# EasyEDA Pro project ProPrj_Lan_Relay_blog_2026-03-05_10-33-51_2026-03-13.epro, board PCB1
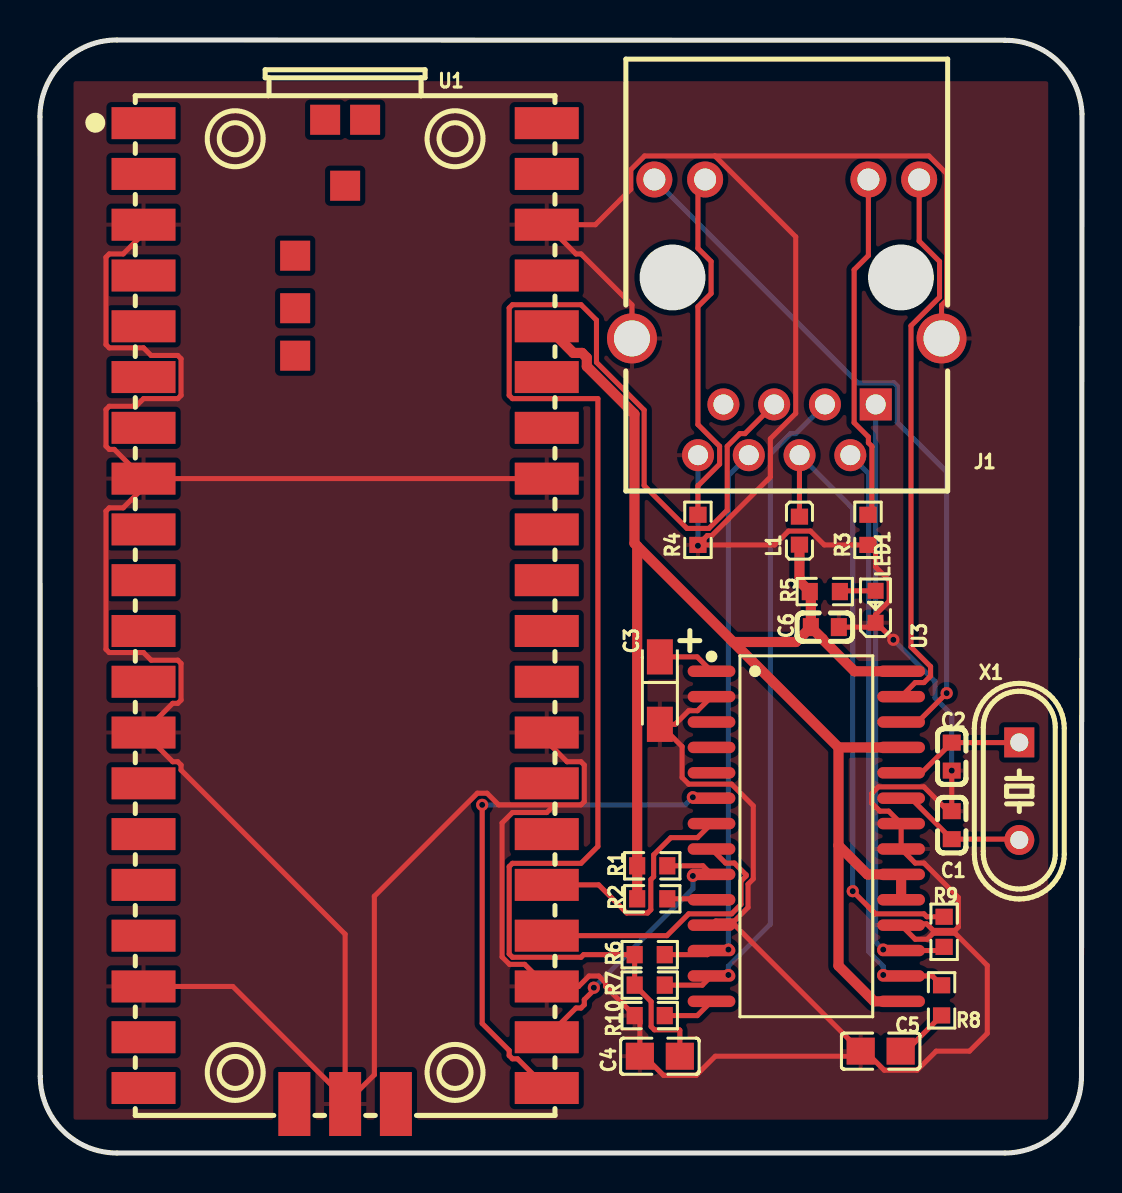
[diagram p3: board, top side]
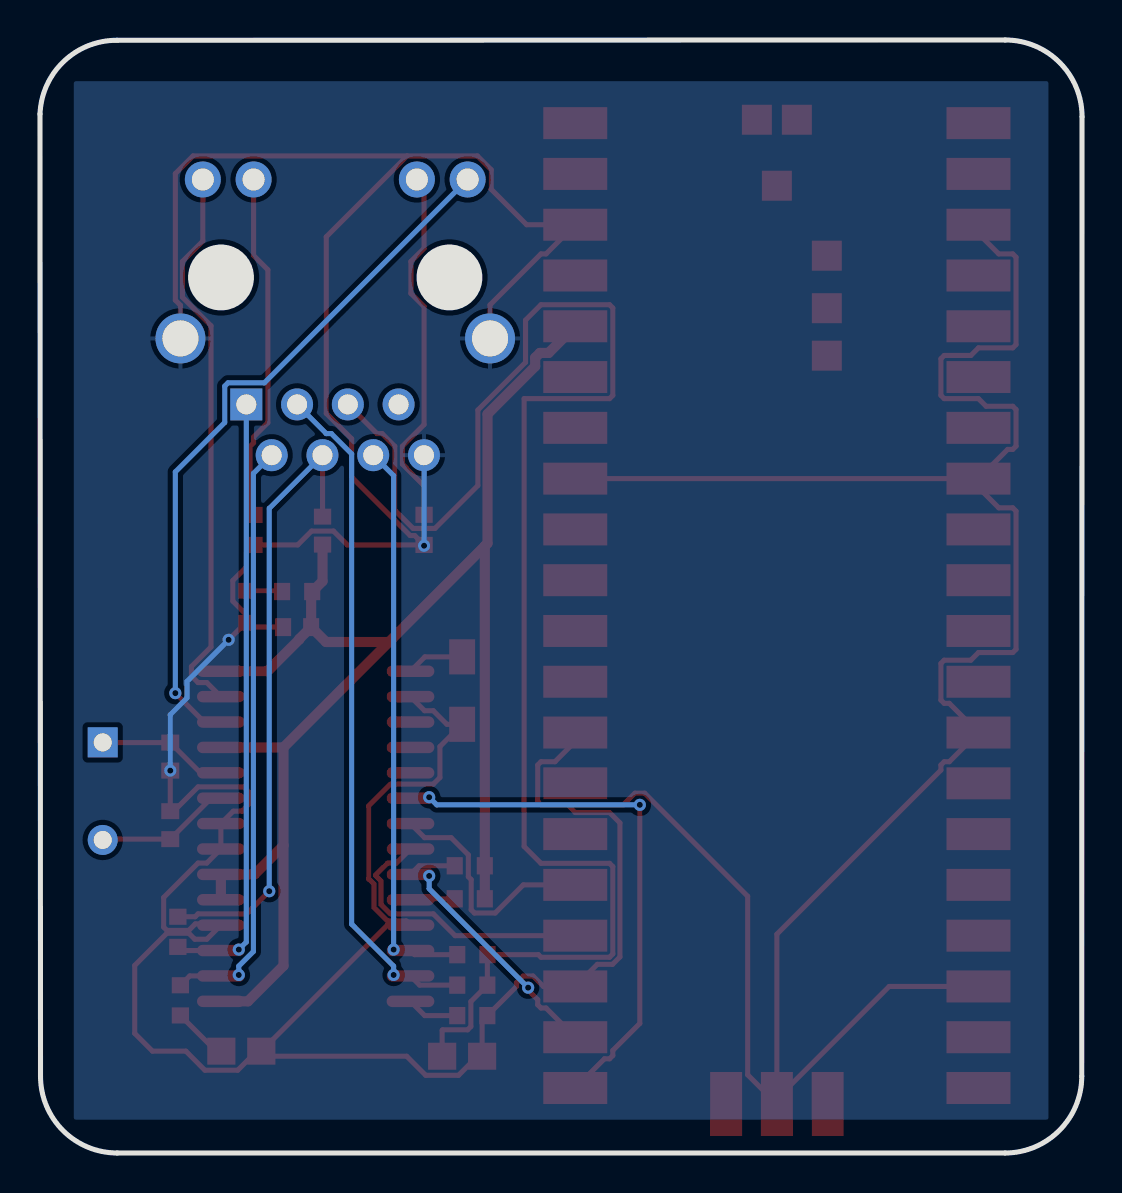
[diagram p4: board, bottom side, seen from below]

Outline 52.14 x 55.67 mm; copper layers: Top Layer, Bottom Layer. Coordinates in mm from the lower left corner of the outline.
Outline path: 0,51.83 arc(1.12,54.55) 3.84,55.67 48.29,55.66 arc(50.96,54.59) 52.14,51.96 52.11,3.84 arc(50.99,1.12) 48.27,0 3.85,0 arc(1.14,1.12) 0.01,3.84 0,51.83
Stack: Top Layer 0.035mm / Dielectric1 1.51mm FR4 er 4.5 / Bottom Layer 0.035mm

## Design rules (mm)
template: JLCPCB Capability(Two Layers Board)
spacing copperThickness1oz (default): track to track 0.102, other pairs 0.152 to 0.3
spacing copperThickness2oz: track to track 0.203, other pairs 0.152 to 0.3
track width copperThickness1oz (default): min 0.127, default 0.254, max 2.54
track width copperThickness2oz: min 0.203, default 0.254, max 2.54
differential pair differentialPair (default): width min 0.127, default 0.254, max 2.54; gap min 0.152, default 0.152
via viaSize (default): diameter min 0.5, default 0.61, max 10; hole min 0.3, default 0.305, max 6.3

## Placement (name value [footprint] x y rotation side)
C1  18pF  [C0603]  45.62 16.4 270 top
C2  18pF  [C0603]  45.62 19.83 90 top
C3  10uF  [CAP-SMD_L3.2-W1.6-RD-C7171]  31.02 23.13 270 top
C4  100nF  [C0805]  31.02 4.84 0 top
C5  100nF  [C0805]  42.07 5.09 0 top
C6  10nF  [C0603]  39.27 26.3 0 top
J1  HR911105A  [RJ45-TH_HR911105A]  37.37 41.8 180 top
L1  GZ1608D601TF  [L0603]  38 31.13 90 top
LED1  KT-0603R  [LED0603-RD]  41.81 27.32 90 top
R1  10kΩ  [R0603]  30.64 14.37 0 top
R2  10kΩ  [R0603]  30.64 12.71 0 top
R3  1kΩ  [R0603]  41.43 31.17 90 top
R4  1kΩ  [R0603]  32.92 31.17 90 top
R5  1kΩ  [R0603]  39.27 28.08 180 top
R6  50Ω  [R0603]  30.51 9.92 0 top
R7  50Ω  [R0603]  30.51 8.4 180 top
R8  50Ω  [R0603]  45.11 7.63 90 top
R9  50Ω  [R0603]  45.24 11.06 90 top
R10  2.32kΩ  [R0603]  30.51 6.87 0 top
U1  PICO  [COMM-SMD_L51.0-W21.0-P2.54_SC0916]  15.27 27.07 270 top
U3  ENC28J60-I/SO  [SOIC-28_L17.9-W7.5-P1.27-LS10.3-BL]  38.35 15.84 270 top
X1  25MHz  [HC-49US_L11.5-W4.5-P4.88]  49 18.1 270 top

## Footprints (pads in the part's own frame, mm; a bottom-side part is the same pattern mirrored in y, then rotated)
C0603
  rect 0.8x0.9 smd: 1(-0.7,0) 2(0.7,0)
C0805
  rect 1.41x1.35 smd: 1(-1,0) 2(1,0)
CAP-SMD_L3.2-W1.6-RD-C7171
  rect 1.758x1.296 smd: 1(-1.687,0) 2(1.687,0)
COMM-SMD_L51.0-W21.0-P2.54_SC0916
  rect 1.6x3.2 smd: 1(-24.445,-10.088) 2(-21.905,-10.088) 3(-19.365,-10.088) 4(-16.825,-10.088) 5(-14.285,-10.088) 6(-11.745,-10.088) 7(-9.205,-10.088) 8(-6.665,-10.088) 9(-4.125,-10.088) 10(-1.585,-10.088) 11(0.955,-10.088) 12(3.495,-10.088) 13(6.035,-10.088) 14(8.575,-10.088) 15(11.115,-10.088) 16(13.655,-10.088) 17(16.195,-10.088) 18(18.735,-10.088) 19(21.275,-10.088) 20(23.815,-10.088) 21(23.815,10.088) 22(21.275,10.088) 23(18.735,10.088) 24(16.195,10.088) 25(13.655,10.088) 26(11.115,10.088) 27(8.575,10.088) 28(6.035,10.088) 29(3.495,10.088) 30(0.955,10.088) 31(-1.585,10.088) 32(-4.125,10.088) 33(-6.665,10.088) 34(-9.205,10.088) 35(-11.745,10.088) 36(-14.285,10.088) 37(-16.825,10.088) 38(-19.365,10.088) 39(-21.905,10.088) 40(-24.445,10.088)
  rect 3.2x1.6 smd: 41(24.615,-2.54) 42(24.615,0) 43(24.615,2.54)
  rect 1.5x1.5 smd: TP1(-21.315,0) TP2(-24.615,1) TP3(-24.615,-1) TP4(-17.815,-2.5) TP5(-15.188,-2.5) TP6(-12.815,-2.5)
HC-49US_L11.5-W4.5-P4.88
  rect 1.5x1.5 hole 0.9: 1(-2.44,0)
  round 1.5 hole 0.9: 2(2.44,0)
L0603
  rect 0.8x0.864 smd: 1(-0.7,0) 2(0.7,0)
LED0603-RD
  rect 0.8x0.8 smd: 1(-0.799,0) 2(0.799,0)
R0603
  rect 0.806x0.864 smd: 1(-0.753,0) 2(0.753,0)
RJ45-TH_HR911105A
  rect 1.6x1.6 hole 1: 1(-4.45,4.355)
  round 1.6 hole 1: 2(-3.18,6.895) 3(-1.91,4.355) 4(-0.64,6.895) 5(0.63,4.355) 6(1.9,6.895) 7(3.17,4.355) 8(4.44,6.895)
  round 1.8 hole 1.1: 9(-6.625,-6.895) 10(-4.085,-6.895) 11(4.085,-6.895) 12(6.625,-6.895)
  round 2.5 hole 1.8: SH1(-7.745,1.055) SH2(7.745,1.055)
SOIC-28_L17.9-W7.5-P1.27-LS10.3-BL
  oval 0.574x2.388 smd: 1(-8.255,-4.744) 2(-6.985,-4.744) 3(-5.715,-4.744) 4(-4.445,-4.744) 5(-3.175,-4.744) 6(-1.905,-4.744) 7(-0.635,-4.744) 8(0.635,-4.744) 9(1.905,-4.744) 10(3.175,-4.744) 11(4.445,-4.744) 12(5.715,-4.744) 13(6.985,-4.744) 14(8.255,-4.744) 15(8.255,4.744) 16(6.985,4.744) 17(5.715,4.744) 18(4.445,4.744) 19(3.175,4.744) 20(1.905,4.744) 21(0.635,4.744) 22(-0.635,4.744) 23(-1.905,4.744) 24(-3.175,4.744) 25(-4.445,4.744) 26(-5.715,4.744) 27(-6.985,4.744) 28(-8.255,4.744)

## Nets
As in the schematic.

Pads without a net: J1 7; U1 1 2 4 5 6 7 9 10 11 12 14 15 16 17 19 20 26 27 29 30 31 32 34 35 37 39 40 41 43 TP1 TP2 TP3 TP4 TP5 TP6; U3 3 4 5

## Via types
v1: diameter 0.61, hole 0.305, Top Layer to Bottom Layer, 13 vias

## Routing (per net, layer and track width the routed paths; a pad name or vN(x,y) marks a point on that pad's centre or on a via; arc(x,y) is an arc through that point)
+3.3V: length 81.9
  Top Layer w0.508: U3.28 40.76,24.1 39.17,25.69 39.17,25.71 C6.1 ; 39.96,20.29 39.96,15.38 ; 39.96,20.29 U3.25 ; 39.96,20.29 34.68,25.56 ; 39.96,15.38 41.4,13.94 U3.20 U3.19 ; 39.96,15.38 39.96,9.36 41.73,7.59 U3.15 ; 29.88,30.36 R1.1 R2.1 ; 29.88,30.36 29.75,30.49 29.75,36.96 27.36,39.34 27.36,39.78 27.12,40.02 26.69,40.02 U1.36 ; 29.88,30.36 34.68,25.56 ; C6.1 38.57,28.03 R5.2 38,28.6 L1.1 ; C6.1 37.83,25.56 34.68,25.56
GND: length 309.6
  Top Layer w0.254: C5.1 40.81,4.84 33.79,4.84 32.84,3.89 31.2,3.89 30.24,4.84 C4.1 30.02,6.61 R10.1 28.3,8.33 28.3,8.51 27.96,8.85 27.47,8.85 26.95,8.33 U1.23 24.25,9.44 23.49,9.44 23.12,9.81 23.12,16.51 23.64,17.03 25.36,17.03 25.74,17.41 ; C5.1 34.77,11.4 U3.11 33.81,11.61 34.75,11.61 35.43,12.28 35.43,13.45 35.69,13.71 35.69,17.36 34.61,18.45 32.46,18.45 32.13,18.78 32.13,20.33 C3.2 31.78,21.44 32.46,22.12 32.9,22.12 U3.2 ; C5.1 41.29,5.09 42.25,4.14 43.89,4.14 44.84,5.09 46.51,5.09 47.4,5.98 47.4,9.38 45.79,10.99 44.69,10.99 44.39,10.69 43.79,10.69 U3.18 43.15,11.46 44.37,11.46 44.69,11.13 45.79,11.13 45.95,11.3 45.95,12.78 44.23,14.5 43.79,14.5 U3.21 U3.22 42.47,17.1 42.03,17.1 41.62,17.51 41.62,17.98 41.95,18.31 44.23,18.31 45.45,17.1 C1.1 v1(45.62,19.13) ; 33.77,49.87 30.25,49.87 29.56,49.18 29.56,48.2 27.79,46.43 U1.38 26.82,44.97 27.07,44.97 29.62,42.42 J1.SH2 ; 33.77,49.87 44.48,49.87 45.37,48.99 45.37,42.66 45.11,42.4 J1.SH1 ; 33.77,49.87 37.82,45.83 37.82,37 36.55,35.73 36.55,33.81 33.62,30.88 33.39,30.88 R4.1 36.76,30.42 37.45,31.11 38.55,31.11 39.24,30.42 R3.1 41.81,30.03 41.81,29.31 42.49,28.63 42.49,27.6 41.81,26.92 LED1.1 ; C6.2 41.6,26.3 LED1.1 ; U1.8 3.72,35.19 3.47,35.19 3.3,35.36 3.3,37.19 3.47,37.35 4.8,37.35 5.18,37.73 6.9,37.73 7.06,37.9 7.06,39.73 6.9,39.89 5.56,39.89 5.18,40.27 3.47,40.27 3.3,40.44 3.3,44.81 3.47,44.97 4.17,44.97 5.18,45.99 U1.3 ; U1.8 U1.33 ; U1.8 5.18,33.29 4.17,32.27 3.47,32.27 3.3,32.11 3.3,25.2 3.47,25.03 5.18,25.03 5.56,24.65 6.9,24.65 7.06,24.49 7.06,22.66 6.9,22.49 6.64,22.49 U1.13 6.64,19.57 6.9,19.57 7.06,19.41 7.06,19.15 15.27,10.94 15.27,2.71 ; 25.74,17.41 27.07,17.41 27.24,17.58 27.24,19.41 27.07,19.57 26.37,19.57 25.36,20.59 U1.28 ; 25.74,17.41 22.96,17.41 22.37,18 21.89,18 16.73,12.84 16.73,3.91 U1.42 15.27,2.71 ; U1.18 9.65,8.33 15.27,2.71 ; LED1.1 41.85,26.52 v1(42.7,25.67)
  Bottom Layer w0.254: v1(45.62,19.13) 45.62,21.92 44.78,22.76 44.78,23.59 v1(42.7,25.67) ; v1(32.92,30.37) 32.92,34.9 J1.8
CS: length 13.6
  Top Layer w0.254: v1(27.72,8.27) 27.72,8.15 27.24,7.67 27.24,7.42 27.07,7.25 26.82,7.25 U1.22 ; R1.2 33.17,14.37 U3.9
  Bottom Layer w0.254: v1(27.72,8.27) 32.67,13.22 v1(32.67,13.86)
LEDA: length 28.2
  Top Layer w0.254: U3.27 43.79,23.53 44.23,23.53 44.56,23.86 44.56,24.33 43.58,25.31 43.58,41.38 45.01,42.8 45.01,44.59 43.99,45.61 J1.9
LEDB: length 35.7
  Top Layer w0.254: U3.26 43.92,21.56 v1(45.37,23)
  Bottom Layer w0.254: J1.12 40.91,38.52 42.73,38.52 42.9,38.36 42.9,36.54 45.37,34.07 v1(45.37,23)
MISO: length 26.3
  Top Layer w0.254: v1(22.13,17.41) 22.13,6.48 23.48,5.13 23.48,4.88 23.64,4.71 23.9,4.71 U1.21
  Bottom Layer w0.254: v1(32.67,17.79) 32.29,17.41 v1(22.13,17.41)
MOSI: length 12.2
  Top Layer w0.254: U1.25 27.96,13.41 29.36,12 30.4,12 30.57,12.17 30.57,13.68 30.71,13.82 30.71,14.91 31.57,15.77 32.9,15.77 U3.7
RESET: length 2.2
  Top Layer w0.254: U3.10 33.55,12.71 R2.2
SCK: length 14.2
  Top Layer w0.254: U3.8 34.31,14.5 34.74,14.5 35.34,13.91 35.34,13.86 35.08,13.6 35.08,12.43 34.61,11.96 32.46,11.96 31.37,10.87 U1.24
TPIN+: length 33.2
  Top Layer w0.254: U3.13 33.14,8.4 R7.1
  Bottom Layer w0.254: v1(34.45,8.9) 34.45,9.35 36.55,11.45 36.55,34.97 37.56,35.98 37.82,35.98 J1.3
TPIN-: length 27.6
  Top Layer w0.254: R6.2 33.4,9.92 U3.12
  Bottom Layer w0.254: v1(34.45,10.17) 34.45,33.88 J1.6
TPOUT+: length 29.7
  Top Layer w0.254: U3.17 45.06,10.13 R9.1
  Bottom Layer w0.254: v1(42.19,10.17) 41.82,10.55 J1.1
TPOUT-: length 28.9
  Top Layer w0.254: R8.2 44.65,8.86 U3.16
  Bottom Layer w0.254: v1(42.19,8.9) 42.19,9.35 41.46,10.08 41.46,33.99 J1.2
$1N1237: length 2.6
  Top Layer w0.254: R10.2 32.89,6.87 U3.14
$1N1253: length 2.9
  Top Layer w0.254: C3.1 32.88,24.82 U3.1
$1N1258: length 33.9
  Top Layer w0.254: L1.2 38,34.9 38.01,34.9 ; v1(40.67,13.1) 41.8,11.96 44.23,11.96 44.38,11.82 R9.2 ; R8.1 43.33,5.09 C5.2
  Bottom Layer w0.254: 38.01,34.9 40.67,32.24 v1(40.67,13.1)
$1N1264: length 79.5
  Top Layer w0.254: J1.5 35.28,35.98 35.02,35.98 34.39,35.35 34.39,32.16 33.47,31.24 32.37,31.24 30.23,33.38 30.23,37.16 27.85,39.54 27.85,41.66 27.07,42.43 23.64,42.43 23.48,42.27 23.48,37.9 23.64,37.73 27.92,37.73 27.92,15.33 27.07,14.49 23.64,14.49 23.48,14.33 23.48,9.96 23.64,9.79 27.07,9.79 27.2,9.92 R6.1 R7.2 30.58,7.57 30.58,6.33 30.74,6.16 31.99,6.16 32.02,6.14 C4.2
$1N1268: length 6.8
  Top Layer w0.254: X1.2 48.96,15.7 C1.2 43.57,17.75 U3.23
$1N1269: length 6.5
  Top Layer w0.254: U3.24 44.11,19.02 C2.2 48.99,20.53 49,20.54
$1N1286: length 17.5
  Top Layer w0.254: J1.10 41.45,44.89 40.74,44.18 40.74,36.53 41.45,35.81 41.45,35.52 41.63,35.35 41.63,32.12 R3.2
$1N1289: length 18.4
  Top Layer w0.254: R4.2 32.92,33.37 34.01,34.46 34.01,35.35 32.92,36.43 32.92,42.33 33.58,42.99 33.58,44.59 32.92,45.25 32.92,48.33 J1.11
$1N1292: length 1.8
  Top Layer w0.254: LED1.2 40.06,28.12 R5.1

## Copper pours and planes (outline as drawn; the poured copper is in the pictures)
GND on Top Layer: 1.68,53.61 1.68,1.67 50.45,1.67 50.45,53.61
GND on Bottom Layer: 1.68,53.61 1.68,1.67 50.45,1.67 50.45,53.61
